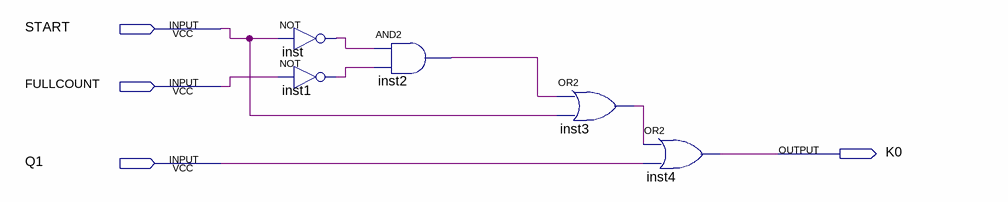
[diagram p0: schematic sheet]
// Quartus schematic K0.bdf as structural Verilog: 5 symbols, 4 pins
module K0 (
  input  START,
  input  FULLCOUNT,
  input  Q1,
  output K0
);

  wire inst1_out, inst2_out, inst3_out, inst_out;

  not inst (inst_out, START);
  not inst1 (inst1_out, FULLCOUNT);
  and inst2 (inst2_out, inst_out, inst1_out);
  or inst3 (inst3_out, inst2_out, START);
  or inst4 (K0, inst3_out, Q1);
endmodule
